# Altium schematic sheet Components.SchDoc
size A4
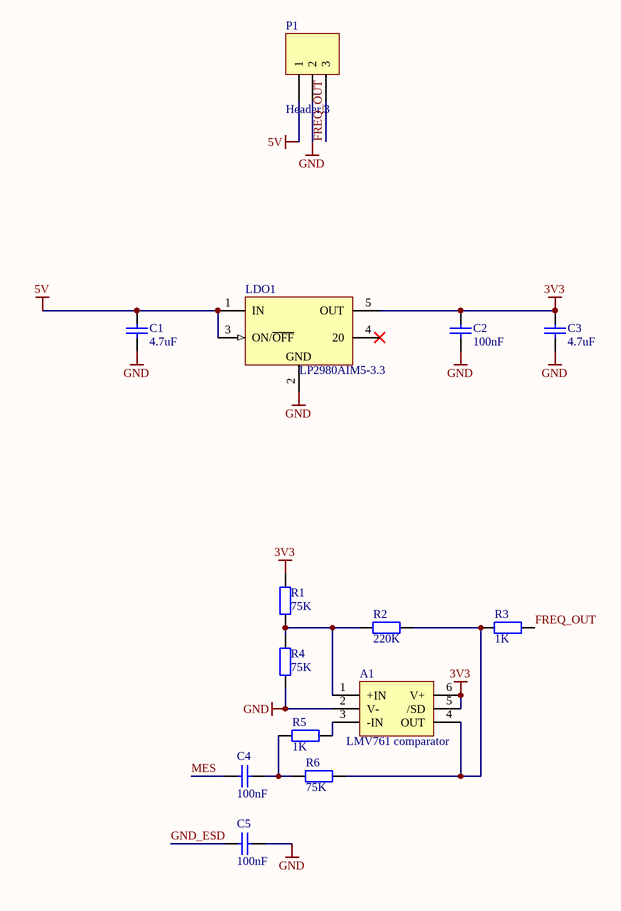
[diagram p0: Components.SchDoc]

## Parts
A1  LMV761 comparator  [ANALOG_SOT23-6]
C1  4.7uF  [FP_0603_CAP_080]
C2  100nF  [FP_0603_CAP_080]
C3  4.7uF  [FP_0603_CAP_080]
C4  100nF  [FP_0603_CAP_080]
C5  100nF  [FP_0603_CAP_080]
LDO1  LP2980AIM5-3.3  [SUPPLY_SOT23-5]
P1  Header 3  [HDR1X3]
R1  75K  [FP_0603_RES]
R2  220K  [FP_0603_RES]
R3  1K  [FP_0603_RES]
R4  75K  [FP_0603_RES]
R5  1K  [FP_0603_RES]
R6  75K  [FP_0603_RES]

## Nets
3V3: A1.5(/SD) A1.6(V+) C2.2 C3.2 LDO1.5(OUT) R1.1
5V: C1.2 LDO1.1(IN) LDO1.3(ON/~{OFF}) P1.1
GND: A1.2(V-) C1.1 C2.1 C3.1 C5.2 LDO1.2(GND) P1.2 R4.2
FREQ_OUT: P1.3 R3.2
GND_ESD: C5.1
MES: C4.1
NetA1_1: A1.1(+IN) R1.2 R2.1 R4.1
NetA1_3: A1.3(-IN) R5.2
NetA1_4: A1.4(OUT) R2.2 R3.1 R6.2
NetC4_2: C4.2 R5.1 R6.1

Not connected (* = marked no-connect by the designer): LDO1 4(20)*

## Library data of the parts
A1 = LMV761: LMV761  precision comparator
C1-C5 = Cap: Capacitor; Order info: TODO; Tûrés: 10%
  C1 C3: Value: 4.7uF
  C2 C4 C5: Value: 100nF
LDO1 = LP2980IM5-3.8: Micropower 50 mA Ultra Low-Dropout Regulator In SOT-23 and micro SMD Packages
P1 = Header 3: Header, 3-Pin; LatestRevisionDate: 17-Jul-2002; LatestRevisionNote: Re-released for DXP Platform.; Publisher: Altium Limited
R1-R6 = Res3: Resistor; Order info: TODO; Tûrés: 5%
  R1 R4 R6: Value: 75K
  R2: Value: 220K
  R3 R5: Value: 1K